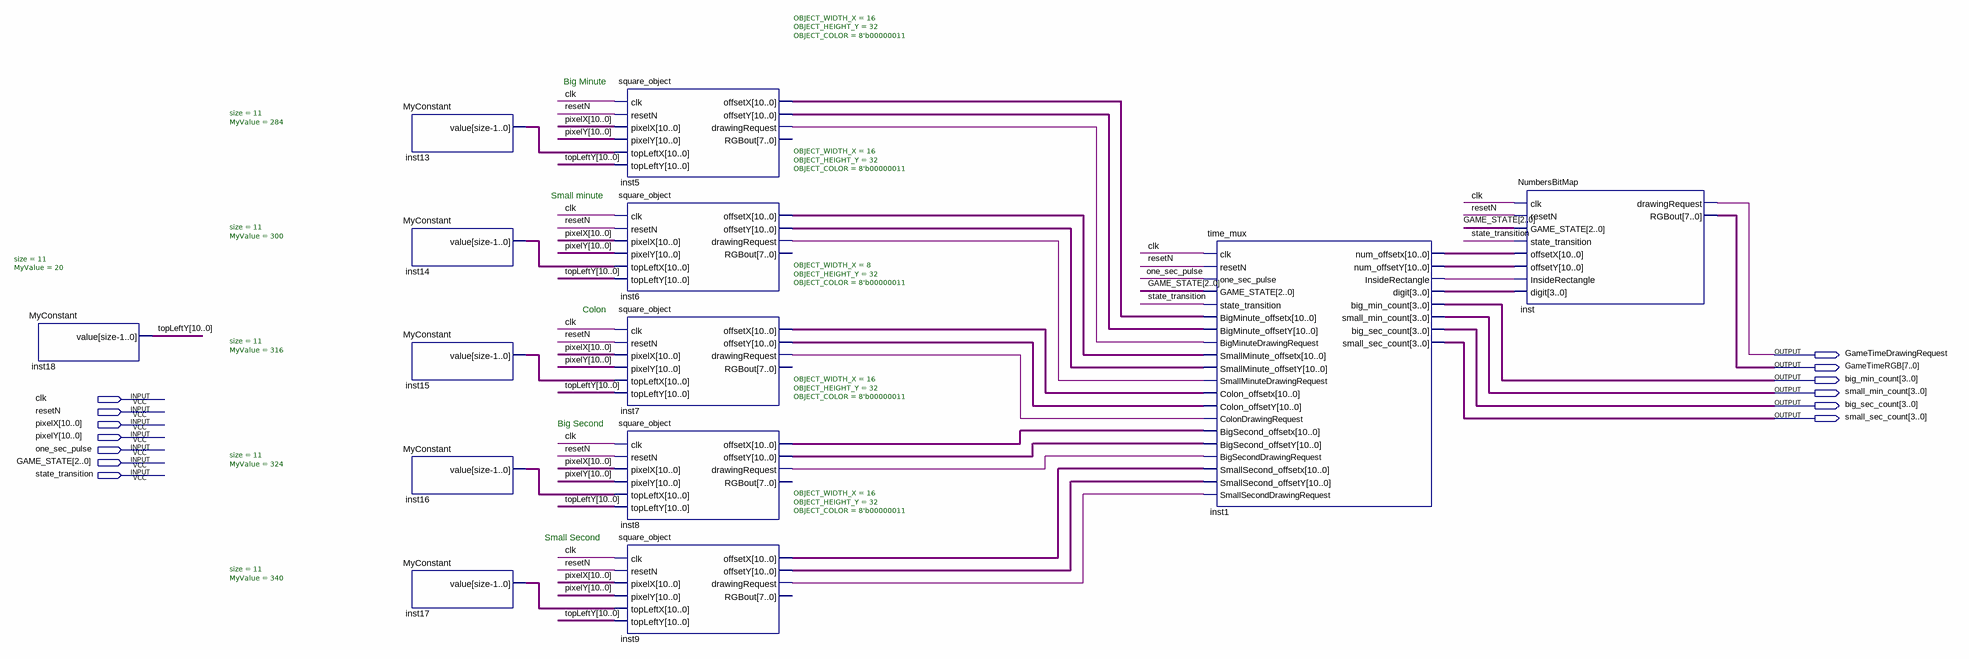
[diagram p0: schematic sheet]
// Quartus schematic GAME_TIME.bdf as structural Verilog: 13 symbols, 13 pins
module GAME_TIME (
  input  clk,
  input  resetN,
  input  [10:0] pixelX,
  input  [10:0] pixelY,
  input  one_sec_pulse,
  input  [2:0] GAME_STATE,
  input  state_transition,
  output GameTimeDrawingRequest,
  output [7:0] GameTimeRGB,
  output [3:0] big_min_count,
  output [3:0] small_min_count,
  output [3:0] big_sec_count,
  output [3:0] small_sec_count
);

  wire inst1_insiderectangle, inst5_drawingrequest, inst6_drawingrequest, inst7_drawingrequest,
       inst8_drawingrequest, inst9_drawingrequest;
  wire [3:0] inst1_digit;
  wire [10:0] inst1_num_offsetx, inst1_num_offsety, inst5_offsetx, inst5_offsety, inst6_offsetx,
       inst6_offsety, inst7_offsetx, inst7_offsety, inst8_offsetx, inst8_offsety, inst9_offsetx,
       inst9_offsety, inst13_value, inst14_value, inst15_value, inst16_value, inst17_value, topLeftY;

  MyConstant #(.size(11), .MyValue(20)) inst18 (.value(topLeftY));
  MyConstant #(.size(11), .MyValue(284)) inst13 (.value(inst13_value));
  MyConstant #(.size(11), .MyValue(300)) inst14 (.value(inst14_value));
  MyConstant #(.size(11), .MyValue(316)) inst15 (.value(inst15_value));
  MyConstant #(.size(11), .MyValue(324)) inst16 (.value(inst16_value));
  MyConstant #(.size(11), .MyValue(340)) inst17 (.value(inst17_value));
  square_object #(.OBJECT_WIDTH_X(16), .OBJECT_HEIGHT_Y(32), .OBJECT_COLOR(8'b00000011)) inst5 (
    .clk(clk), .resetN(resetN), .pixelX(pixelX), .pixelY(pixelY), .topLeftX(inst13_value),
    .topLeftY(topLeftY), .offsetX(inst5_offsetx), .offsetY(inst5_offsety),
    .drawingRequest(inst5_drawingrequest));  // open: RGBout
  square_object #(.OBJECT_WIDTH_X(16), .OBJECT_HEIGHT_Y(32), .OBJECT_COLOR(8'b00000011)) inst6 (
    .clk(clk), .resetN(resetN), .pixelX(pixelX), .pixelY(pixelY), .topLeftX(inst14_value),
    .topLeftY(topLeftY), .offsetX(inst6_offsetx), .offsetY(inst6_offsety),
    .drawingRequest(inst6_drawingrequest));  // open: RGBout
  square_object #(.OBJECT_WIDTH_X(8), .OBJECT_HEIGHT_Y(32), .OBJECT_COLOR(8'b00000011)) inst7 (
    .clk(clk), .resetN(resetN), .pixelX(pixelX), .pixelY(pixelY), .topLeftX(inst15_value),
    .topLeftY(topLeftY), .offsetX(inst7_offsetx), .offsetY(inst7_offsety),
    .drawingRequest(inst7_drawingrequest));  // open: RGBout
  square_object #(.OBJECT_WIDTH_X(16), .OBJECT_HEIGHT_Y(32), .OBJECT_COLOR(8'b00000011)) inst8 (
    .clk(clk), .resetN(resetN), .pixelX(pixelX), .pixelY(pixelY), .topLeftX(inst16_value),
    .topLeftY(topLeftY), .offsetX(inst8_offsetx), .offsetY(inst8_offsety),
    .drawingRequest(inst8_drawingrequest));  // open: RGBout
  square_object #(.OBJECT_WIDTH_X(16), .OBJECT_HEIGHT_Y(32), .OBJECT_COLOR(8'b00000011)) inst9 (
    .clk(clk), .resetN(resetN), .pixelX(pixelX), .pixelY(pixelY), .topLeftX(inst17_value),
    .topLeftY(topLeftY), .offsetX(inst9_offsetx), .offsetY(inst9_offsety),
    .drawingRequest(inst9_drawingrequest));  // open: RGBout
  time_mux inst1 (
    .clk(clk), .resetN(resetN), .one_sec_pulse(one_sec_pulse), .GAME_STATE(GAME_STATE),
    .state_transition(state_transition), .BigMinute_offsetx(inst5_offsetx),
    .BigMinute_offsetY(inst5_offsety), .BigMinuteDrawingRequest(inst5_drawingrequest),
    .SmallMinute_offsetx(inst6_offsetx), .SmallMinute_offsetY(inst6_offsety),
    .SmallMinuteDrawingRequest(inst6_drawingrequest), .Colon_offsetx(inst7_offsetx),
    .Colon_offsetY(inst7_offsety), .ColonDrawingRequest(inst7_drawingrequest),
    .BigSecond_offsetx(inst8_offsetx), .BigSecond_offsetY(inst8_offsety),
    .BigSecondDrawingRequest(inst8_drawingrequest), .SmallSecond_offsetx(inst9_offsetx),
    .SmallSecond_offsetY(inst9_offsety), .SmallSecondDrawingRequest(inst9_drawingrequest),
    .num_offsetx(inst1_num_offsetx), .num_offsetY(inst1_num_offsety),
    .InsideRectangle(inst1_insiderectangle), .digit(inst1_digit), .big_min_count(big_min_count),
    .small_min_count(small_min_count), .big_sec_count(big_sec_count), .small_sec_count(small_sec_count));
  NumbersBitMap inst (
    .clk(clk), .resetN(resetN), .GAME_STATE(GAME_STATE), .state_transition(state_transition),
    .offsetX(inst1_num_offsetx), .offsetY(inst1_num_offsety), .InsideRectangle(inst1_insiderectangle),
    .digit(inst1_digit), .drawingRequest(GameTimeDrawingRequest), .RGBout(GameTimeRGB));

  // Notes on the sheet:
  //   Big Minute
  //   Small minute
  //   Colon
  //   Big Second
  //   Small Second
endmodule
